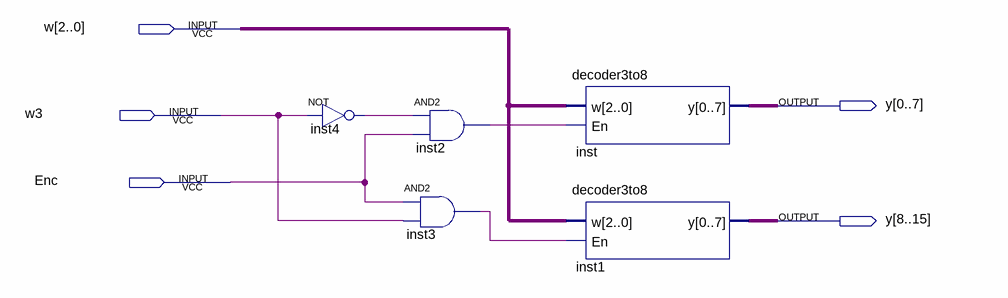
[diagram p0: schematic sheet]
// Quartus schematic decoder4to16.bdf as structural Verilog: 5 symbols, 5 pins
module decoder4to16 (
  input  [2:0] w,
  input  w3,
  input  Enc,
  output [0:15] y
);

  wire inst2_out, inst3_out, inst4_out;

  not inst4 (inst4_out, w3);
  and inst2 (inst2_out, inst4_out, Enc);
  and inst3 (inst3_out, Enc, w3);
  decoder3to8 inst (.w(w), .En(inst2_out), .y(y[0:7]));
  decoder3to8 inst1 (.w(w), .En(inst3_out), .y(y[8:15]));
endmodule
